# EAGLE design M113D (EAGLE 6.6.0)
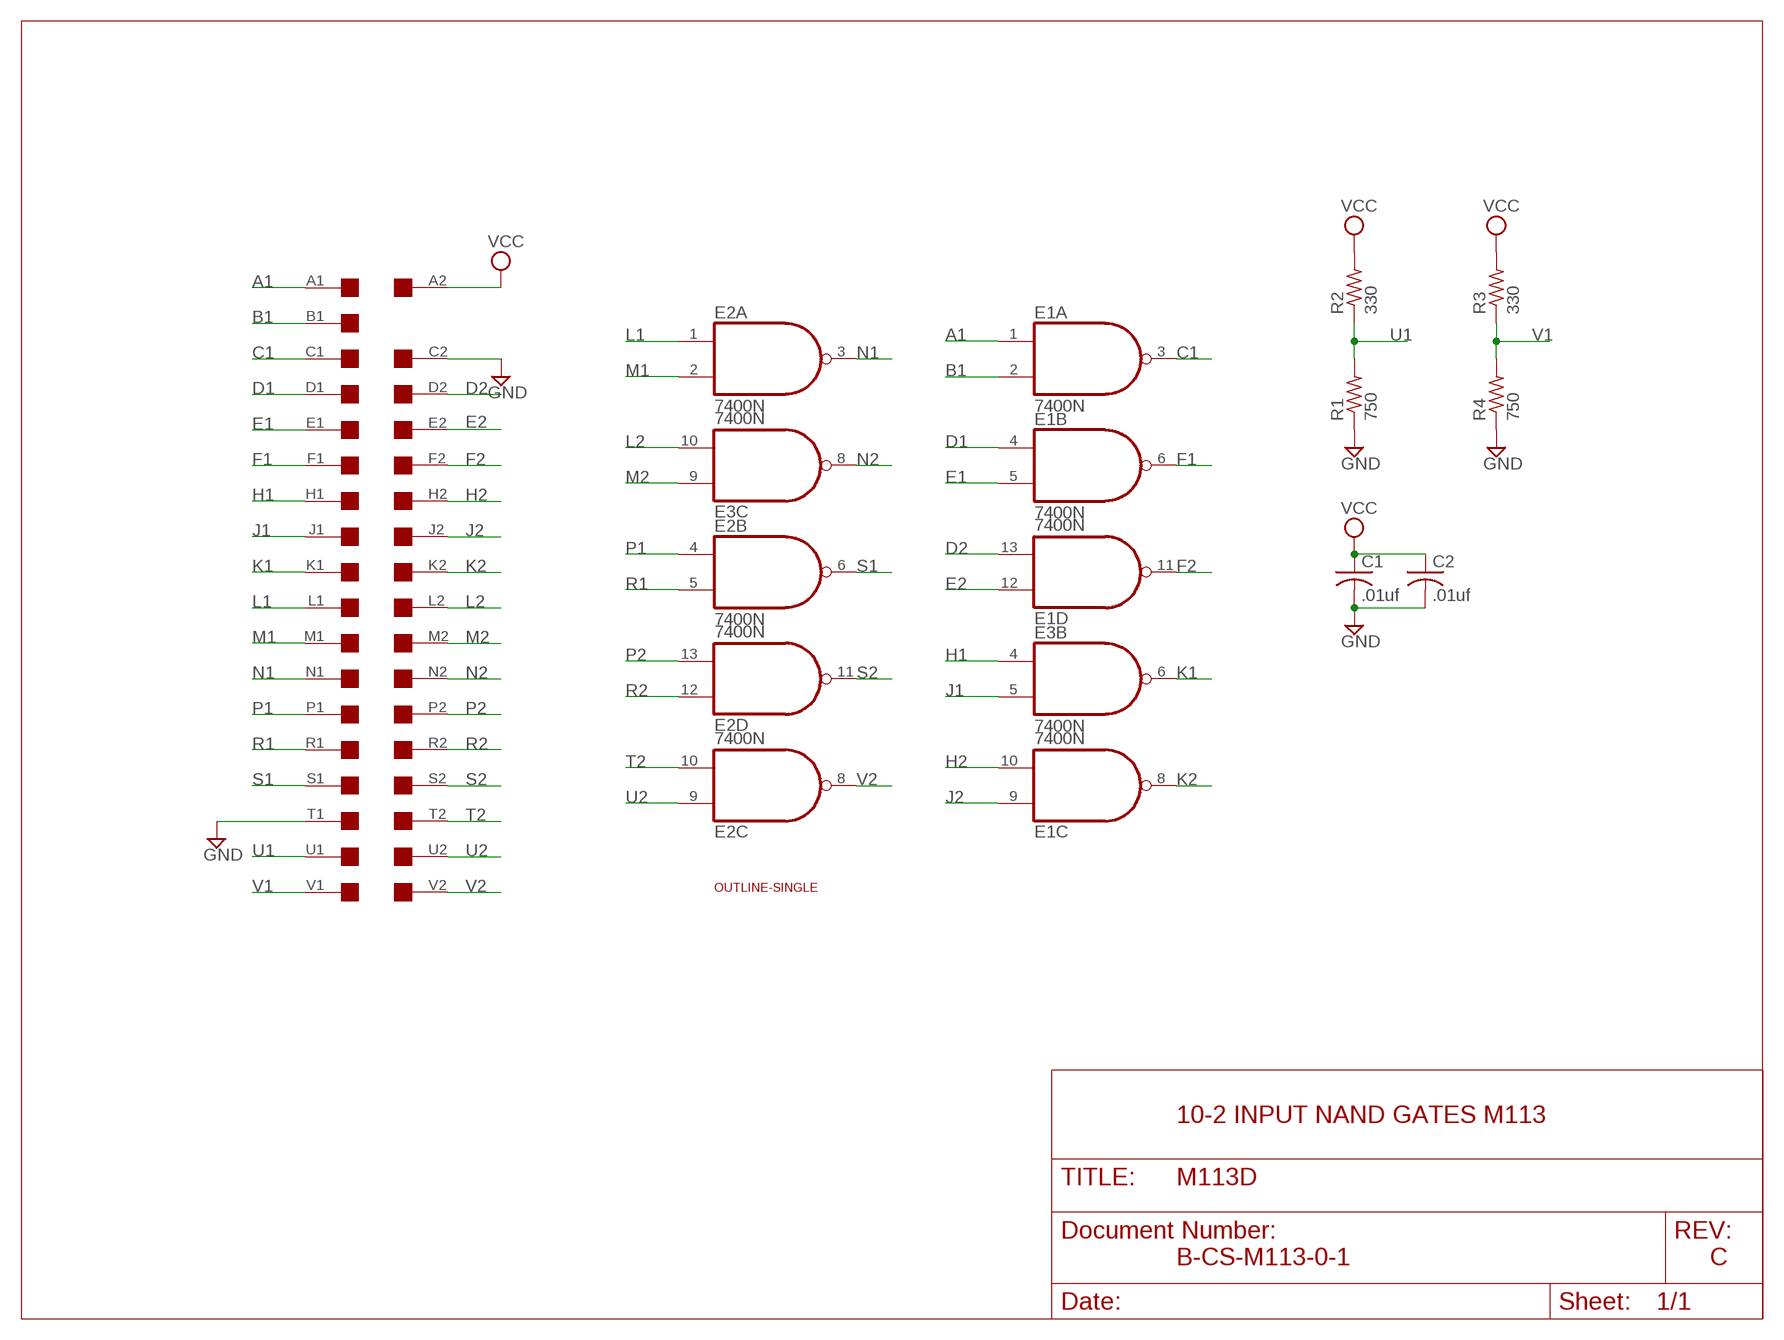
[diagram p0: schematic, sheet 1]

## Parts
C1  .01uf  C-US050-025X075  [C050-025X075]
C2  .01uf  C-US050-025X075  [C050-025X075]
E1  7400N  [DIL14]
E2  7400N  [DIL14]
E3  7400N  [DIL14]
R1  750  R-US_0207/10  [0207/10]
R2  330  R-US_0207/10  [0207/10]
R3  330  R-US_0207/10  [0207/10]
R4  750  R-US_0207/10  [0207/10]
U$1  SINGLE  [EDGE-CON2]
U$2  OUTLINE-SINGLE  [SINGLE]

## Nets
A1: E1.1(A:I0) U$1.A1
B1: E1.2(A:I1) U$1.B1
C1: E1.3(A:O) U$1.C1
D1: E1.4(B:I0) U$1.D1
D2: E1.13(D:I1) U$1.D2
E1: E1.5(B:I1) U$1.E1
E2: E1.12(D:I0) U$1.E2
F1: E1.6(B:O) U$1.F1
F2: E1.11(D:O) U$1.F2
GND [Supply]: C1.2 C2.2 R1.1 R4.1 U$1.C2 U$1.T1
H1: E3.4(B:I0) U$1.H1
H2: E1.10(C:I1) U$1.H2
J1: E3.5(B:I1) U$1.J1
J2: E1.9(C:I0) U$1.J2
K1: E3.6(B:O) U$1.K1
K2: E1.8(C:O) U$1.K2
L1: E2.1(A:I0) U$1.L1
L2: E3.10(C:I1) U$1.L2
M1: E2.2(A:I1) U$1.M1
M2: E3.9(C:I0) U$1.M2
N1: E2.3(A:O) U$1.N1
N2: E3.8(C:O) U$1.N2
P1: E2.4(B:I0) U$1.P1
P2: E2.13(D:I1) U$1.P2
R1: E2.5(B:I1) U$1.R1
R2: E2.12(D:I0) U$1.R2
S1: E2.6(B:O) U$1.S1
S2: E2.11(D:O) U$1.S2
T2: E2.10(C:I1) U$1.T2
U1: R1.2 R2.1 U$1.U1
U2: E2.9(C:I0) U$1.U2
V1: R3.1 R4.2 U$1.V1
V2: E2.8(C:O) U$1.V2
VCC [Supply]: C1.1 C2.1 R2.2 R3.2 U$1.A2
Unconnected: E3.1(A:I0) E3.2(A:I1) E3.3(A:O) E3.11(D:O) E3.12(D:I0) E3.13(D:I1) U$1.B2

## Notes on the sheet
- 10-2 INPUT NAND GATES M113
- B-CS-M113-0-1 | C

## Power pins joined to a net without a drawn wire
GND: E1.7(P:GND) E2.7(P:GND) E3.7(P:GND)
VCC: E1.14(P:VCC) E2.14(P:VCC) E3.14(P:VCC)

## Library data of the parts
C1 C2 = rcl:C-US: CAPACITOR, American symbol
E1-E3 = 74xx-us:74*00: Quad 2-input NAND gate
R1-R4 = rcl:R-US_: RESISTOR, American symbol
U$1 = dec-con:SINGLE: Single-Height DEC board
U$2 = dec-con:OUTLINE-*: Board outlines for DEC boards.

## Net classes
1 Supply: width 0.813 mm

## Board
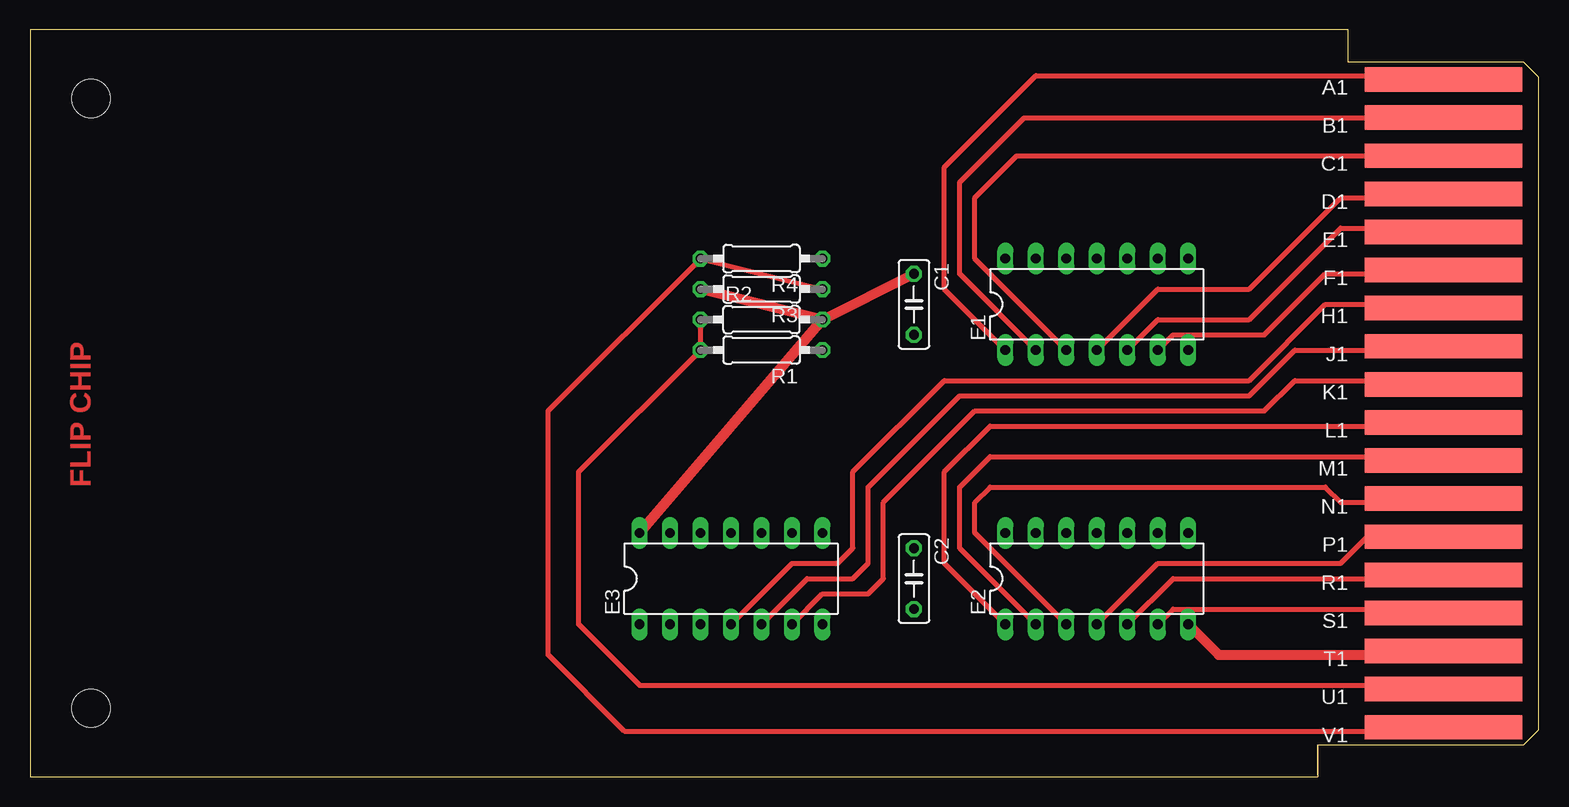
[diagram p1: board, top side]
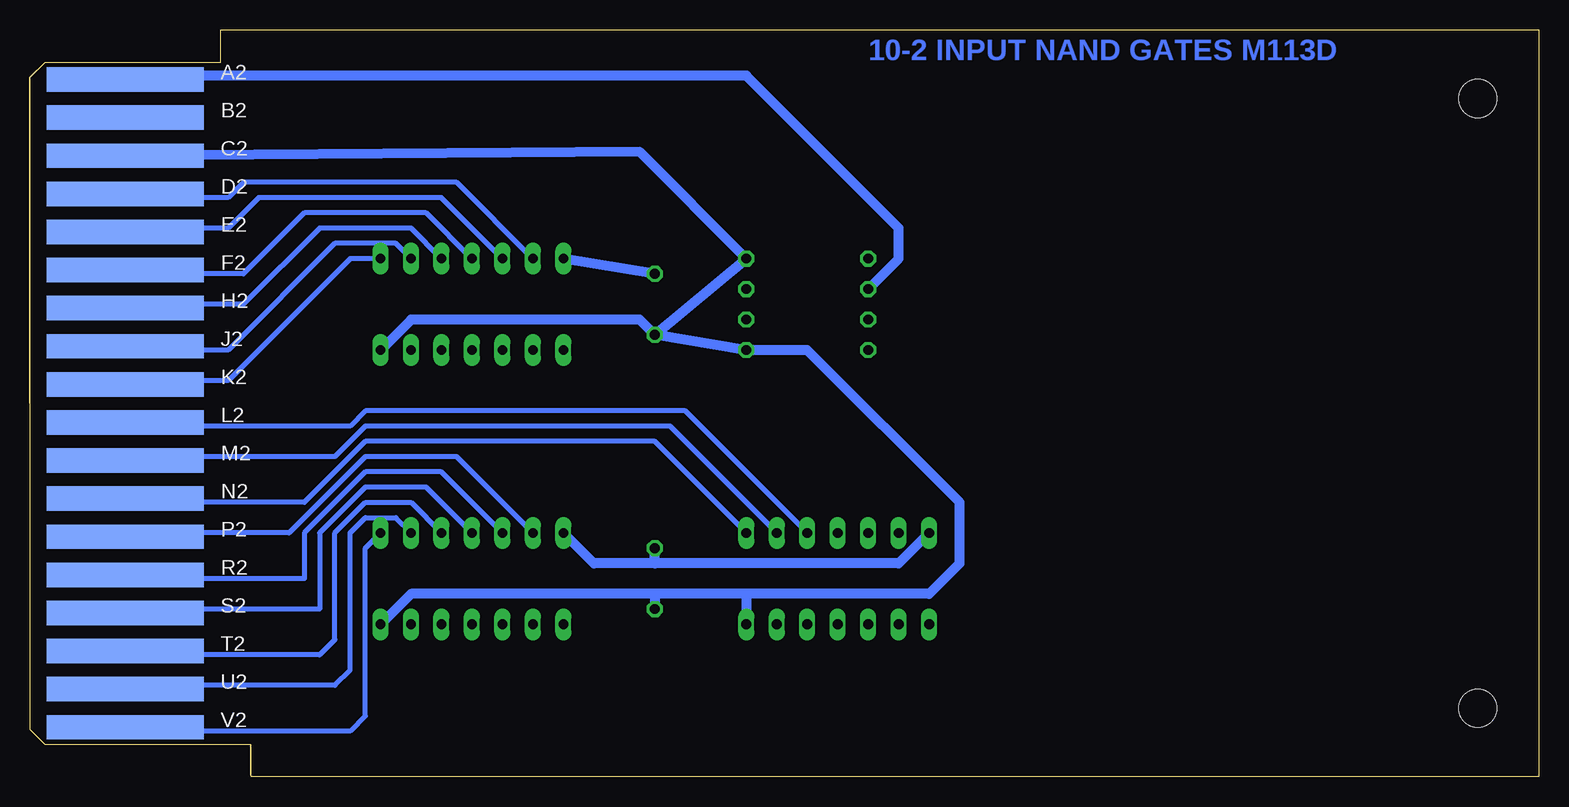
[diagram p2: board, bottom side, seen from below]

Size 125.73 x 62.23 mm. Coordinates in mm from the lower left corner, seen from the top.
Copper layers (1+16): Top 0.035mm / dielectric 1.5mm / Bottom 0.035mm
Design rules "16mils": minimum track width 16mil, minimum drill 32mil, track to track 15mil, track to pad 10mil, pad to pad 10mil, via to via 10mil, smd to smd 10mil, copper to edge 13mil, drill to drill 10mil, minimum pad ring 10mil, minimum via ring 8mil, stop-mask expansion 0mil, vias tented up to drill 0mil, thermal gap 10mil

### Footprints (pad centres in the part's own frame; a part is rotated, then mirrored left to right if it is on the bottom)
C050-025X075 = drill 0.813 octagon: 1 -2.54,0; 2 2.54,0
DIL14 = drill 0.813 long: 1 -7.62,-3.81; 2 -5.08,-3.81; 3 -2.54,-3.81; 4 0,-3.81; 5 2.54,-3.81; 6 5.08,-3.81; 7 7.62,-3.81; 8 7.62,3.81; 9 5.08,3.81; 10 2.54,3.81; 11 0,3.81; 12 -2.54,3.81; 13 -5.08,3.81; 14 -7.62,3.81
0207/10 = drill 0.813 octagon: 1 -5.08,0; 2 5.08,0
EDGE-CON2 = smd 13.106 x 2.032: A1 7.938,4.128; B1 7.938,7.303; C1 7.938,10.477; D1 7.938,13.652; E1 7.938,16.828; F1 7.938,20.003; H1 7.938,23.177; J1 7.938,26.352; K1 7.938,29.527; L1 7.938,32.703; M1 7.938,35.877; N1 7.938,39.053; P1 7.938,42.227; R1 7.938,45.403; S1 7.938,48.578; T1 7.938,51.752; U1 7.938,54.928; V1 7.938,58.102 | smd 13.106 x 2.032 bottom: A2 7.938,4.128; B2 7.938,7.303; C2 7.938,10.477; D2 7.938,13.652; E2 7.938,16.828; F2 7.938,20.003; H2 7.938,23.177; J2 7.938,26.352; K2 7.938,29.527; L2 7.938,32.703; M2 7.938,35.877; N2 7.938,39.053; P2 7.938,42.227; R2 7.938,45.403; S2 7.938,48.578; T2 7.938,51.752; U2 7.938,54.928; V2 7.938,58.102
SINGLE = hole 3.175: 120.65,56.515; 120.65,5.715

### Placement (x,y rotation side)
C1  73.66,39.37 270 top
C2  73.66,16.51 270 top
E1  88.9,39.37 0 top
E2  88.9,16.51 0 top
E3  58.42,16.51 0 top
R1  60.96,35.56 180 top
R2  60.96,38.1 0 top
R3  60.96,40.64 180 top
R4  60.96,43.18 180 top
U$1  125.73,62.23 180 top
U$2  125.73,62.23 180 top

### Tracks (layer width: path | path; a pad name or v marks a point on that pad's centre or on a via)
A1
  Top 0.406: U$1.A1 111.76,58.42 83.82,58.42 83.42,58.02 76.2,50.8 76.2,40.64 E1.1
B1
  Top 0.406: U$1.B1 82.84,54.9 77.47,49.53 77.47,41.91 E1.2
C1
  Top 0.406: U$1.C1 82.22,51.74 78.74,48.26 78.74,43.18 E1.3
D1
  Top 0.406: E1.4 93.98,40.64 101.6,40.64 109.22,48.26 111.76,48.26 U$1.D1
D2
  Bottom 0.406: E1.13 90.17,49.53 107.95,49.53 109.22,48.26 111.76,48.26 U$1.D2
E1
  Top 0.406: E1.5 93.98,38.1 101.6,38.1 109.22,45.72 111.76,45.72 U$1.E1
E2
  Bottom 0.406: E1.12 91.44,48.26 106.68,48.26 109.22,45.72 111.76,45.72 U$1.E2
F1
  Top 0.406: U$1.F1 111.76,41.91 107.95,41.91 102.87,36.83 95.25,36.83 E1.6
F2
  Bottom 0.406: E1.11 92.71,46.99 102.87,46.99 107.95,41.91 111.76,41.91 U$1.F2
GND
  Top 0.813: U$1.T1 111.76,10.16 99.06,10.16 E2.7
  Bottom 0.813: U$1.C2 74.93,52.07 R4.1 C1.2 | C1.2 R1.1 60.96,35.56 48.26,22.86 48.26,17.78 50.8,15.24 66.04,15.24 | C1.2 74.93,38.1 93.98,38.1 E1.7 | 66.04,15.24 E3.7 | E2.7 93.98,15.24 73.66,15.24 | 66.04,15.24 73.66,15.24 | 73.66,15.24 C2.2
H1
  Top 0.406: E3.4 63.5,17.78 67.31,17.78 68.58,19.05 68.58,25.4 76.2,33.02 101.6,33.02 107.95,39.37 111.76,39.37 U$1.H1
H2
  Bottom 0.406: E1.10 93.98,45.72 101.6,45.72 107.95,39.37 111.76,39.37 U$1.H2
J1
  Top 0.406: U$1.J1 111.76,35.56 105.41,35.56 101.6,31.75 77.47,31.75 69.85,24.13 69.85,17.78 68.58,16.51 64.77,16.51 E3.5
J2
  Bottom 0.406: E1.9 95.25,44.45 100.33,44.45 109.22,35.56 111.76,35.56 U$1.J2
K1
  Top 0.406: E3.6 66.04,15.24 69.85,15.24 71.12,16.51 71.12,22.86 78.74,30.48 102.87,30.48 105.41,33.02 111.76,33.02 U$1.K1
K2
  Bottom 0.406: U$1.K2 111.76,33.02 109.22,33.02 99.06,43.18 E1.8
L1
  Top 0.406: E2.1 76.2,17.78 76.2,25.4 80.01,29.21 111.76,29.21 112.09,29.54 U$1.L1
L2
  Bottom 0.406: U$1.L2 111.76,29.21 99.06,29.21 97.79,30.48 71.12,30.48 E3.10
M1
  Top 0.406: E2.2 77.47,19.05 77.47,24.13 80.01,26.67 111.76,26.67 112.09,26.34 U$1.M1
M2
  Bottom 0.406: E3.9 72.39,29.21 97.79,29.21 100.33,26.67 111.76,26.67 U$1.M2
N1
  Top 0.406: U$1.N1 112.09,23.19 111.76,22.86 109.22,22.86 107.95,24.13 80.01,24.13 78.74,22.86 78.74,20.32 E2.3
N2
  Bottom 0.406: U$1.N2 111.76,22.86 102.87,22.86 97.79,27.94 73.66,27.94 E3.8
P1
  Top 0.406: U$1.P1 111.76,20.32 109.22,17.78 93.98,17.78 E2.4
P2
  Bottom 0.406: U$1.P2 111.76,20.32 104.14,20.32 97.79,26.67 90.17,26.67 E2.13
R1
  Top 0.406: U$1.R1 111.76,16.51 95.25,16.51 E2.5
R2
  Bottom 0.406: E2.12 91.44,25.4 97.79,25.4 102.87,20.32 102.87,16.51 111.76,16.51 U$1.R2
S1
  Top 0.406: U$1.S1 111.76,13.97 95.25,13.97 E2.6
S2
  Bottom 0.406: E2.11 92.71,24.13 97.79,24.13 101.6,20.32 101.6,13.97 111.76,13.97 U$1.S2
T2
  Bottom 0.406: U$1.T2 111.76,10.16 101.6,10.16 100.33,11.43 100.33,20.32 97.79,22.86 93.98,22.86 E2.10
U1
  Top 0.406: U$1.U1 111.76,7.62 50.8,7.62 45.72,12.7 45.72,25.4 R1.2 R2.1
U2
  Bottom 0.406: U$1.U2 111.76,7.62 100.33,7.62 99.06,8.89 99.06,20.32 97.79,21.59 95.25,21.59 E2.9
V1
  Top 0.406: U$1.V1 112.15,4.2 111.76,3.81 49.53,3.81 43.18,10.16 43.18,30.48 R4.2 R3.1
V2
  Bottom 0.406: U$1.V2 111.76,3.81 99.06,3.81 97.79,5.08 97.79,19.05 E2.8
VCC
  Top 0.813: R2.2 C1.1 | E3.14 R2.2 | R2.2 R3.2
  Bottom 0.813: U$1.A2 111.76,58.42 66.04,58.42 53.34,45.72 53.34,43.18 R3.2 | C1.1 E1.14 | E3.14 53.34,17.78 73.66,17.78 | 73.66,17.78 78.74,17.78 E2.14 | 73.66,17.78 C2.1

### Text on the board
Top: FLIP CHIP
Bottom: 10-2 INPUT NAND GATES M113D